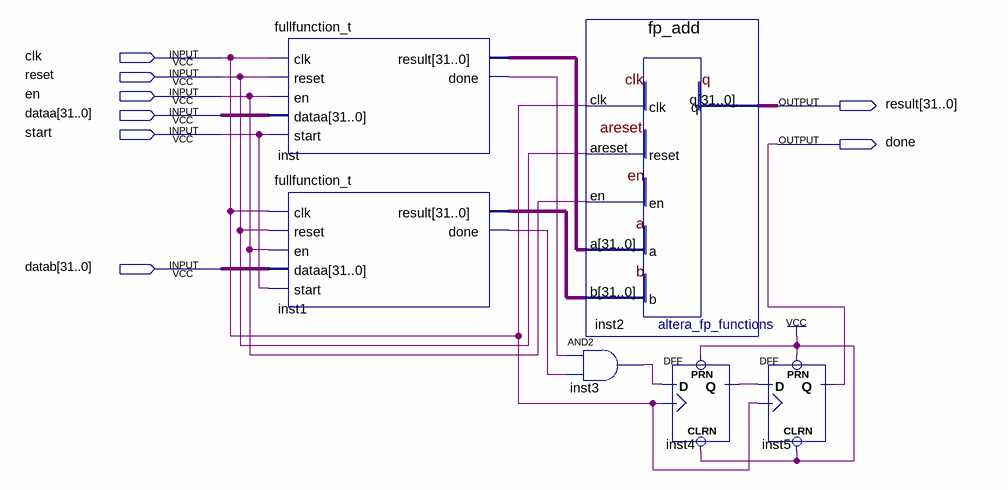
[diagram p0: schematic sheet]
// Quartus schematic dualfunction_t.bdf as structural Verilog: 6 symbols, 8 pins
module dualfunction_t (
  input  clk,
  input  reset,
  input  en,
  input  [31:0] dataa,
  input  start,
  input  [31:0] datab,
  output [31:0] result,
  output done
);

  wire inst1_done, inst3_out, inst4_q, inst_done;
  wire [31:0] inst1_result, inst_result;

  fullfunction_t inst (
    .clk(clk), .reset(reset), .en(en), .dataa(dataa), .start(start), .result(inst_result), .done(inst_done));
  fullfunction_t inst1 (
    .clk(clk), .reset(reset), .en(en), .dataa(datab), .start(start), .result(inst1_result), .done(inst1_done));
  fp_add inst2 (.clk(clk), .areset(reset), .en(en), .a(inst_result), .b(inst1_result), .q(result));
  and inst3 (inst3_out, inst_done, inst1_done);
  DFF inst4 (.CLRN(1'b1), .CLK(clk), .D(inst3_out), .PRN(1'b1), .Q(inst4_q));
  DFF inst5 (.CLRN(1'b1), .CLK(clk), .D(inst4_q), .PRN(1'b1), .Q(done));
endmodule
